# EasyEDA Pro project ProPrj_SunLight.epro

# Schematic Schematic1
Assembly Variant: Basic; Board Name: Board1; Create Date: 2026-07-05; Page Name: P1; Project Name: SunLight; Schematic Name: Schematic1; Update Date: 2026-07-05; Company: 嘉立创EDA; Page Size: A4; Version: V1.0
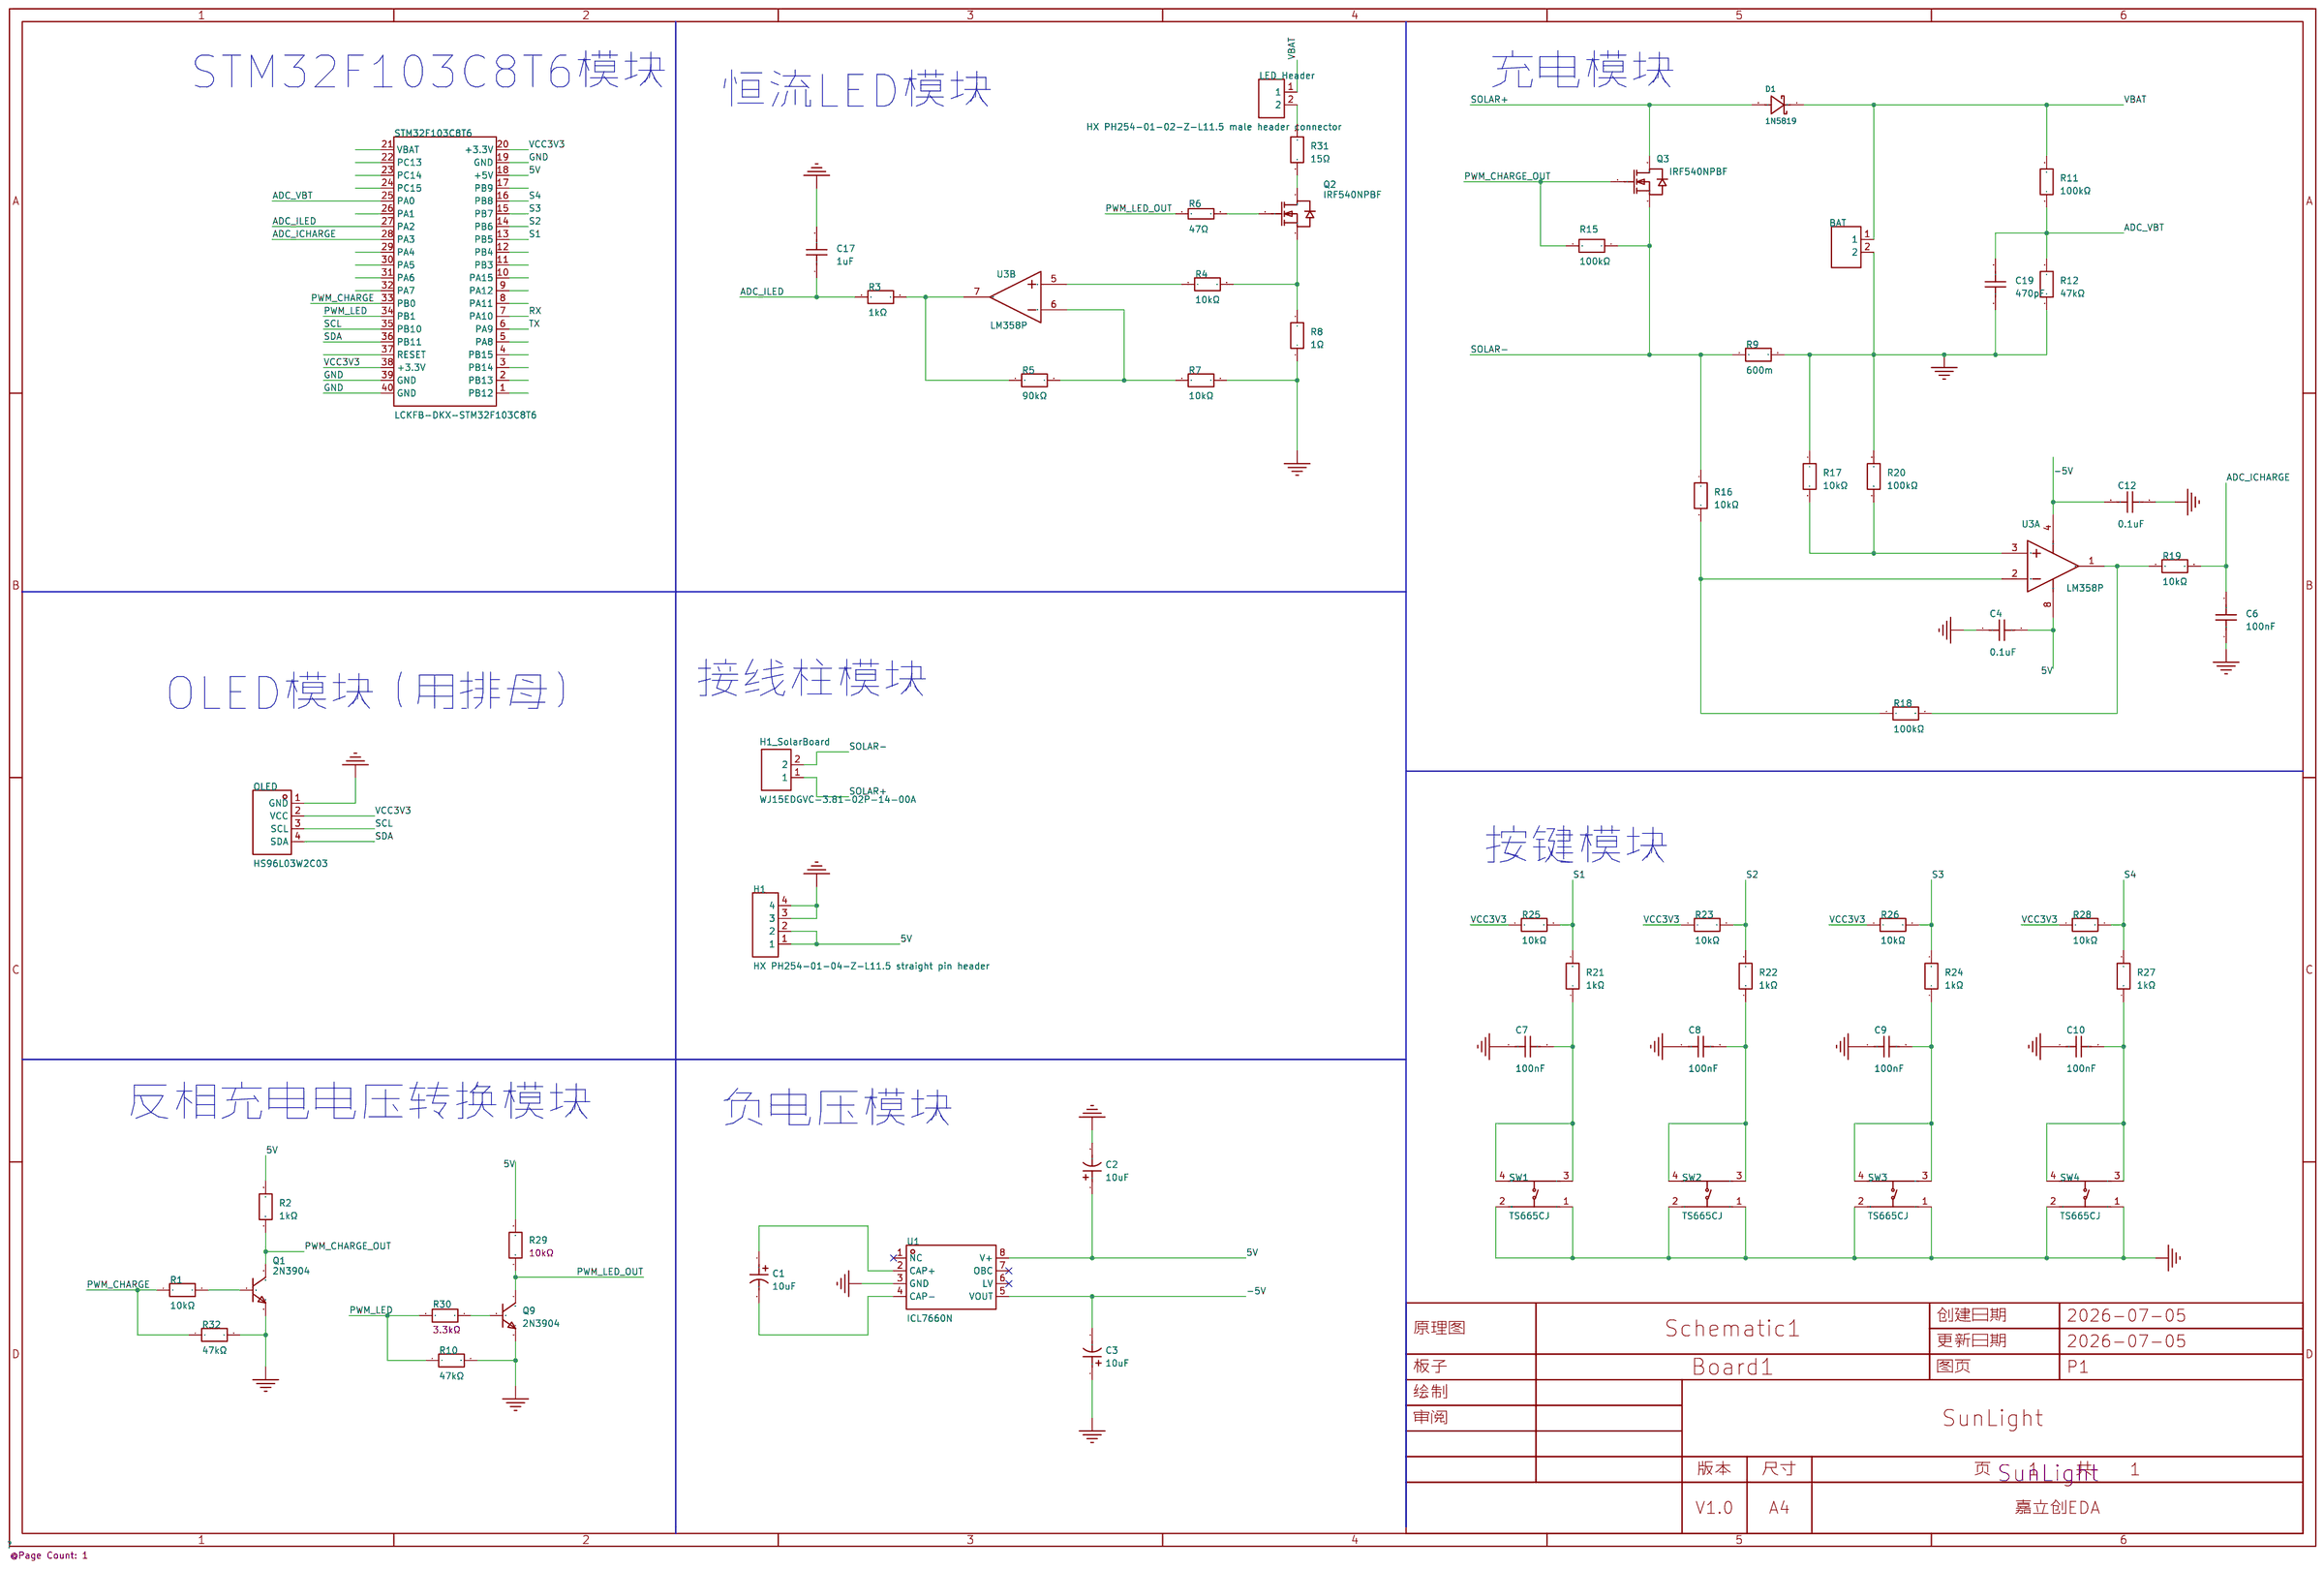
[diagram p0: schematic sheet]

## Parts
BAT  WJ15EDGVC-3.81-02P-14-00A  [CONN-TH_WJ15EDGVC-3.81-2P]
C1  10uF  [CAP-TH_BD10.0-P5.00-D0.6-FD_1]
C2  10uF  [CAP-TH_BD10.0-P5.00-D0.6-FD_1]
C3  10uF  [CAP-TH_BD10.0-P5.00-D0.6-FD_1]
C4  0.1uF  [CC1H104ZA1FD3F6C1000]
C6  100nF  [CAP-TH_L5.5-W4.0-P5.00-D0.5]
C7  100nF  [CAP-TH_L5.5-W4.0-P5.00-D0.5]
C8  100nF  [CAP-TH_L5.5-W4.0-P5.00-D0.5]
C9  100nF  [CAP-TH_L5.5-W4.0-P5.00-D0.5]
C10  100nF  [CAP-TH_L5.5-W4.0-P5.00-D0.5]
C12  0.1uF  [CC1H104ZA1FD3F6C1000]
C17  1uF  [CAP-TH_L5.8-W2.8]
C19  470pF  [CAP-TH_L5.5-W4.0-P5.00-D0.5]
D1  1N5819  [DO-41_BD2.4-L4.7-P8.70-D0.9-RD]
H1  HX PH254-01-04-Z-L11.5 straight pin header  [HDR-TH_4P-HX-PH254-01-04-Z-L11.5]
H1_SolarBoard  WJ15EDGVC-3.81-02P-14-00A  [CONN-TH_WJ15EDGVC-3.81-2P]
LED_Header  HX PH254-01-02-Z-L11.5 male header connector  [HDR-TH_2P-P2.54-V-M]
OLED  HS96L03W2C03  [OLED-TH_L27.8-W27.2-P2.54_C9900033791]
Q1  2N3904  [TO-92-3_L4.6-W3.6-P1.27-L_1]
Q2  IRF540NPBF  [TO-220-3_L10.0-W4.5-P2.54-L]
Q3  IRF540NPBF  [TO-220-3_L10.0-W4.5-P2.54-L]
Q9  2N3904  [TO-92-3_L4.6-W3.6-P1.27-L_1]
R1  10kΩ  [RES-TH_BD2.7-L6.2-P10.20-D0.4]
R2  1kΩ  [RES-TH_BD2.7-L6.2-P10.20-D0.4]
R3  1kΩ  [RES-TH_BD2.7-L6.2-P10.20-D0.4]
R4  10kΩ  [RES-TH_BD2.7-L6.2-P10.20-D0.4]
R5  90kΩ  [RES-TH_BD2.7-L6.2-P10.20-D0.4]
R6  47Ω  [RES-TH_BD2.4-L6.3-P10.30-D0.6]
R7  10kΩ  [RES-TH_BD2.7-L6.2-P10.20-D0.4]
R8  1Ω  [RES-TH_BD2.7-L6.2-P10.20-D0.4]
R9  600m  [RES-TH_BD2.7-L6.2-P10.20-D0.4]
R10  47kΩ  [RES-TH_BD2.7-L6.2-P10.20-D0.4]
R11  100kΩ  [RES-TH_BD2.7-L6.2-P10.20-D0.4]
R12  47kΩ  [RES-TH_BD2.7-L6.2-P10.20-D0.4]
R15  100kΩ  [RES-TH_BD2.7-L6.2-P10.20-D0.4]
R16  10kΩ  [RES-TH_BD2.7-L6.2-P10.20-D0.4]
R17  10kΩ  [RES-TH_BD2.7-L6.2-P10.20-D0.4]
R18  100kΩ  [RES-TH_BD2.7-L6.2-P10.20-D0.4]
R19  10kΩ  [RES-TH_BD2.7-L6.2-P10.20-D0.4]
R20  100kΩ  [RES-TH_BD2.7-L6.2-P10.20-D0.4]
R21  1kΩ  [RES-TH_BD2.7-L6.2-P10.20-D0.4]
R22  1kΩ  [RES-TH_BD2.7-L6.2-P10.20-D0.4]
R23  10kΩ  [RES-TH_BD2.7-L6.2-P10.20-D0.4]
R24  1kΩ  [RES-TH_BD2.7-L6.2-P10.20-D0.4]
R25  10kΩ  [RES-TH_BD2.7-L6.2-P10.20-D0.4]
R26  10kΩ  [RES-TH_BD2.7-L6.2-P10.20-D0.4]
R27  1kΩ  [RES-TH_BD2.7-L6.2-P10.20-D0.4]
R28  10kΩ  [RES-TH_BD2.7-L6.2-P10.20-D0.4]
R29  1kΩ  [RES-TH_BD2.7-L6.2-P10.20-D0.4]
R30  1kΩ  [RES-TH_BD2.7-L6.2-P10.20-D0.4]
R31  15Ω  [RES-TH_BD2.7-L6.2-P10.20-D0.4]
R32  47kΩ  [RES-TH_BD2.7-L6.2-P10.20-D0.4]
STM32F103C8T6  LCKFB-DKX-STM32F103C8T6  [CONN-TH_L53.3-W22.9_STM32F103C8T6-CARD]
SW1  TS665CJ  [SW-TH_4P-L6.0-W6.0-P4.50-LS6.5]
SW2  TS665CJ  [SW-TH_4P-L6.0-W6.0-P4.50-LS6.5]
SW3  TS665CJ  [SW-TH_4P-L6.0-W6.0-P4.50-LS6.5]
SW4  TS665CJ  [SW-TH_4P-L6.0-W6.0-P4.50-LS6.5]
U1  ICL7660N  [DIP-8_L9.4-W6.4-P2.54-LS9.1-BL]
U3  LM358P  [DIP-8_L9.7-W6.4-P2.54-LS7.6-BL]  (sections 1,2)

## Library data of the parts
BAT H1_SolarBoard = WJ15EDGVC-3.81-02P-14-00A: 连接器类型:板端/插座-闭口;固定方式:-;结构:1x2P;间距:3.81mm;颜色:绿色;安装方式:直插;排数:1;每排PIN数:2;额定电流:8A;额定电压:300V;线规 - AWG:-;线规 - 平方毫米:-;工作温度:-40℃~+105℃;; LCSC Part Name: 1x2P 3.81mm 排数:1 每排P数:2; Supplier Part: C8396; Manufacturer: KANGNEX(康奈克斯电气); Supplier Footprint: 插件,P=3.81mm; JLCPCB Part Class: Extended Part; Datasheet: https://item.szlcsc.com/datasheet/WJ15EDGVC-3.81-02P-14-00A/8890.html; Supplier: LCSC; Connector Type: 板端/插座-闭口; Number of Positions or Pins: 1x2P; Pitch: 3.81mm; Color: 绿色; Mounting Type: 直插; Number of Pins: 2P; Number of Rows: 1; Number of PINs Per Row: 2; Current Rating: 8A; Voltage Rating (Max): 300V; Operating Temperature: -40℃~+105℃
C1-C3 = ERG450V10M10x16: 容值:10uF;精度:±20%;额定电压:450V;纹波电流:100mA@100kHz;等效串联电阻(ESR):9.45Ω@100kHz;; LCSC Part Name: 10uF ±20% 450V; Supplier Part: C46552835; Manufacturer: JIERR(捷而瑞); Supplier Footprint: 插件,D10xL16mm; JLCPCB Part Class: Extended Part; Datasheet: https://item.szlcsc.com/datasheet/ERG450V10M10x16/48687203.html; Supplier: LCSC; Tolerance: ±20%; Voltage Rating: 450V; Ripple Current: 100mA@100kHz; Equivalent Series Resistance(ESR): 9.45Ω@100kHz; Pin Spacing: 5mm; Diameter: 10mm; Height - Seated (Max): 16mm; Lifetime: 2000hrs@105℃; Operating Temperature: -25℃~+105℃
C4 C12 = CC1H104ZA1ED3F5O1100: 容值:100nF;精度:-20%~+80%;额定电压:50V;温度系数:Y5V;; LCSC Part Name: 100nF -20%~+80% 50V; Supplier Part: C2761728; Manufacturer: Dersonic(德尔创); Supplier Footprint: 插件,P=2.54mm; JLCPCB Part Class: 扩展库; Datasheet: https://atta.szlcsc.com/upload/public/pdf/source/20211025/1A7587EB9213FE403B9063878B9D301B.pdf; Supplier: LCSC; Tolerance: -20%~+80%; Voltage Rated: 50V; Lead Spacing: 2.54mm; Temperature Coefficient: Y5V; φD: 5.8mm; Body Thickness: 2.6mm
C6-C10 C19 = Y5P102K2KV16CC0224: 容值:1nF;精度:±10%;额定电压:2kV;温度系数:SL;; LCSC Part Name: 1nF ±10% 2kV; Supplier Part: C2887266; Manufacturer: KNSCHA(科尼盛); Supplier Footprint: 插件,P=5mm; JLCPCB Part Class: Extended Part; Datasheet: https://item.szlcsc.com/datasheet/Y5P102K2KV16CC0224/3103834.html; Supplier: LCSC; Tolerance: ±10%; Voltage Rating: 2kV; Pin Spacing: 5mm; Temperature Coefficient: SL
C17 = CC1H104MC1FD3F6C10SA: 容值:100nF;精度:±20%;额定电压:50V;温度系数:Y5V;; LCSC Part Name: 100nF ±20% 50V; Supplier Part: C5375966; Manufacturer: Dersonic(德尔创); Supplier Footprint: 插件,P=5.08mm; JLCPCB Part Class: Extended Part; Datasheet: https://item.szlcsc.com/datasheet/CC1H104MC1FD3F6C10SA/6236644.html; Supplier: LCSC; Tolerance: ±20%; Voltage Rating: 50V; Pin Spacing: 5.08mm; Temperature Coefficient: Y5V; Diameter: 5.8mm; Body Thickness: 2.4mm
D1 = 1N5819_C54795756: 二极管配置:1个独立式;正向压降(Vf):550mV@1A;直流反向耐压(Vr):40V;整流电流:1A;; Supplier Part: C54795756; Manufacturer: R+O(宏嘉诚); Supplier Footprint: DO-41; JLCPCB Part Class: Extended Part; Datasheet: https://item.szlcsc.com/datasheet/1N5819/58234768.html; Supplier: LCSC; Diode Configuration: 1个独立式; Voltage - Forward(Vf@If): 550mV@1A; Voltage - DC Reverse(Vr): 40V; Current - Rectified: 1A; Reverse Leakage Current (Ir): 200uA@40V
H1 = HX PH254-01-04-Z-L11.5 straight pin header: 插针结构:1x4P;间距:2.54mm;圆针/方针:方针;安装方式:直插;排数:单排;总PIN位数:4P;额定电流:3A;额定电压:1kV;配合针长度:6mm;塑高:2.5mm;端接针长度:3mm;触头材质:黄铜;触头镀层:金;工作温度:-40℃~+105℃;; LCSC Part Name: 1x4P 间距:2.54mm 方针 直插; Supplier Part: C52016392; Manufacturer: hanxia(韩下); Supplier Footprint: 插件,P=2.54mm; JLCPCB Part Class: Extended Part; Datasheet: https://item.szlcsc.com/datasheet/HX%2520PH254-01-04-Z-L11.5%2520straight%2520pin%2520header/54760437.html; Supplier: LCSC; Pin Structure: 1x4P; Pitch: 2.54mm; Circluar Pins/Square Pins: 方针; Mounting Type: 直插; Number of Rows: 单排; Number of Pins: 4P; Current Rating: 3A; Voltage Rating (Max): 1kV; Length of Mating Pin: 6mm; Insulation Height: 2.5mm; Length of End Connection Pin: 3mm; Contact Material: 黄铜; Contact Plating: 金; Operating Temperature: -40℃~+105℃
LED_Header = HX PH254-01-02-Z-L11.5 male header connector: 插针结构:1x2P;间距:2.54mm;圆针/方针:方针;安装方式:直插;排数:单排;总PIN位数:2P;额定电流:3A;额定电压:1kV;配合针长度:6mm;塑高:2.5mm;端接针长度:3mm;触头材质:黄铜;触头镀层:金;工作温度:-40℃~+105℃;; LCSC Part Name: 1x2P 间距:2.54mm 方针 直插; Supplier Part: C52016390; Manufacturer: hanxia(韩下); Supplier Footprint: 插件,P=2.54mm; JLCPCB Part Class: Extended Part; Datasheet: https://item.szlcsc.com/datasheet/HX%2520PH254-01-02-Z-L11.5%2520male%2520header%2520connector/54760435.html; Supplier: LCSC; Pin Structure: 1x2P; Pitch: 2.54mm; Circluar Pins/Square Pins: 方针; Mounting Type: 直插; Number of Rows: 单排; Number of Pins: 2P; Current Rating: 3A; Voltage Rating (Max): 1kV; Length of Mating Pin: 6mm; Insulation Height: 2.5mm; Length of End Connection Pin: 3mm; Contact Material: 黄铜; Contact Plating: 金; Operating Temperature: -40℃~+105℃
OLED = HS96L03W2C03: 核心芯片:SSD1315芯片;接口类型:I2C;尺寸(inch):0.96;像素分辨率:128x64;; LCSC Part Name: 0.96寸OLED显示屏窄白光IIC; Supplier Part: C5248080; Manufacturer: HS(汉昇); JLCPCB Part Class: Extended Part; Datasheet: https://item.szlcsc.com/datasheet/HS96L03W2C03/5960631.html; Supplier: LCSC; Controller Type: SSD1315芯片; Interface: I2C; Size: 0.96; Dot Pixels: 128x64; Operating Temperature: -40℃~+70℃; Type of Drive: 无源(PMOLED); Display Range: 21.744x10.864mm; Display Color: 白色; Luminance: 180cd/m2
Q1 Q9 = 2N3904_C2874602: 晶体管类型:NPN;集电极电流(Ic):200mA;集射极击穿电压(Vceo):40V;耗散功率(Pd):625mW;直流电流增益(hFE):-;; LCSC Part Name: NPN 电流:200mA 电压:40V; Supplier Part: C2874602; Manufacturer: JSMSEMI(杰盛微); Supplier Footprint: TO-92; JLCPCB Part Class: Extended Part; Datasheet: https://item.szlcsc.com/datasheet/2N3904/3079917.html; Supplier: LCSC; type: NPN; Current - Collector(Ic): 200mA; Collector - Emitter Voltage VCEO: 40V; Pd - Power Dissipation: 625mW; Transition frequency(fT): 300MHz; Current - Collector Cutoff: 50nA; Vce Saturation(VCE(sat)): 300mV@50mA,5.0mA; Operating Temperature: -55℃~+150℃; Emitter-Base Voltage(Vebo): 6V; Number: 1个NPN
Q2 Q3 = IRF540NPBF: 类型:1个N沟道;漏源电压(Vdss):100V;连续漏极电流(Id):33A;导通电阻(RDS(on)@Vgs,Id):44mΩ@10V,16A;功率(Pd):130W;阈值电压(Vgs(th)@Id):4V@250uA;; LCSC Part Name: 1个N沟道 耐压:100V 电流:33A; Supplier Part: C2566; Manufacturer: Infineon(英飞凌); Supplier Footprint: TO-220AB; JLCPCB Part Class: Extended Part; Datasheet: https://atta.szlcsc.com/upload/public/pdf/source/20140818/1457707225950.pdf; Supplier: LCSC; Type: 1个N沟道; Drain Source Voltage (Vdss): 100V; Continuous Drain Current (Id): 33A; Drain Source On Resistance (RDS(on)@Vgs,Id): 44mΩ@10V,16A; Power Dissipation (Pd): 130W; Gate Threshold Voltage (Vgs(th)@Id): 4V@250uA; Total Gate Charge (Qg@Vgs): 71nC; Input Capacitance (Ciss@Vds): 1.96nF; Reverse Transfer Capacitance (Crss@Vds): 40pF; Operating Temperature: -55℃~+175℃
R1-R5 R7-R9 R11 R12 R15-R28 = MF1/4W-1K±1%-ST52: 电阻类型:金属膜电阻;阻值:1kΩ;精度:±1%;功率:250mW;温度系数:±100ppm/℃;; LCSC Part Name: 金属膜电阻 1kΩ ±1% 250mW; Supplier Part: C2903245; Manufacturer: VO(翔胜); Supplier Footprint: 插件,D2.7xL6.2mm; JLCPCB Part Class: Extended Part; Datasheet: https://item.szlcsc.com/datasheet/MF1%252F4W-1K%25C2%25B11%2525-ST52/3158996.html; Supplier: LCSC; Type: 金属膜电阻; Tolerance: ±1%; Voltage-Supply(Max): 250V; Power(Watts): 250mW; Temperature Coefficient: ±100ppm/℃; Operating Temperature: -55℃~+155℃
R6 = MFR-25FTE52-47R: 电阻类型:金属膜电阻;阻值:47Ω;精度:±1%;功率:250mW;温度系数:±50ppm/℃;; LCSC Part Name: 金属膜电阻 47Ω ±1% 250mW 铜脚，圆柱状直插; Supplier Part: C173022; Manufacturer: YAGEO(国巨); Supplier Footprint: 插件,D2.4xL6.3mm; JLCPCB Part Class: Extended Part; Datasheet: https://item.szlcsc.com/datasheet/MFR-25FTE52-47R/184411.html; Supplier: LCSC; Type: 金属膜电阻; Tolerance: ±1%; Power(Watts): 250mW; Temperature Coefficient: ±50ppm/℃; Operating Temperature: -55℃~+155℃
R10 R32 = MF1/4W-47K±1%-ST52: 电阻类型:金属膜电阻;阻值:47kΩ;精度:±1%;功率:250mW;温度系数:±350ppm/℃;; LCSC Part Name: 金属膜电阻 47kΩ ±1% 250mW; Supplier Part: C2857423; Manufacturer: VO(翔胜); Supplier Footprint: 插件,D2.7xL6.2mm; JLCPCB Part Class: Extended Part; Supplier: LCSC; Type: 金属膜电阻; Tolerance: ±1%; Overload Voltage (Max): 250V; Power(Watts): 250mW; Temperature Coefficient: ±350ppm/℃; Operating Temperature Range: -55℃~+155℃
R29 = MF1/4W-1K±1%-ST52: 电阻类型:金属膜电阻;阻值:1kΩ;精度:±1%;功率:250mW;温度系数:±100ppm/℃;; LCSC Part Name: 金属膜电阻 1kΩ ±1% 250mW; Supplier Part: C2903245; Manufacturer: VO(翔胜); Supplier Footprint: 插件,D2.7xL6.2mm; JLCPCB Part Class: Extended Part; Datasheet: https://item.szlcsc.com/datasheet/MF1%252F4W-1K%25C2%25B11%2525-ST52/3158996.html; Supplier: LCSC; Type: 金属膜电阻; Tolerance: ±1%; Voltage-Supply(Max): 250V; Power(Watts): 250mW; Temperature Coefficient: ±100ppm/℃; Operating Temperature: -55℃~+155℃; Resistance: 10kΩ
R30 = MF1/4W-1K±1%-ST52: 电阻类型:金属膜电阻;阻值:1kΩ;精度:±1%;功率:250mW;温度系数:±100ppm/℃;; LCSC Part Name: 金属膜电阻 1kΩ ±1% 250mW; Supplier Part: C2903245; Manufacturer: VO(翔胜); Supplier Footprint: 插件,D2.7xL6.2mm; JLCPCB Part Class: Extended Part; Datasheet: https://item.szlcsc.com/datasheet/MF1%252F4W-1K%25C2%25B11%2525-ST52/3158996.html; Supplier: LCSC; Type: 金属膜电阻; Tolerance: ±1%; Voltage-Supply(Max): 250V; Power(Watts): 250mW; Temperature Coefficient: ±100ppm/℃; Operating Temperature: -55℃~+155℃; Resistance: 3.3kΩ
R31 = MF1/4W-4Ω7±1%-OT26: 电阻类型:金属膜电阻;阻值:4.7Ω;精度:±1%;功率:250mW;温度系数:±400ppm/℃;; LCSC Part Name: 金属膜电阻 4.7Ω ±1% 250mW; Supplier Part: C2843026; Manufacturer: VO(翔胜); Supplier Footprint: 插件,D2.7xL6.2mm; JLCPCB Part Class: Extended Part; Datasheet: https://item.szlcsc.com/datasheet/MF1%252F4W-4%25CE%25A97%25C2%25B11%2525-OT26/3029405.html; Supplier: LCSC; Type: 金属膜电阻; Tolerance: ±1%; Voltage-Supply(Max): 250V; Power(Watts): 250mW; Temperature Coefficient: ±400ppm/℃; Operating Temperature: -55℃~+155℃
STM32F103C8T6 = LCKFB-DKX-STM32F103C8T6: 搭载Contex M3内核,程序存储容量64KB,RAM总容量20KB,最高72MHz主频,提供高效的计算能力和稳定的运行环境。; LCSC Part Name: 立创·地阔星-STM32F103C8T6开发板; Supplier Part: C22396880; Manufacturer: 立创开发板; JLCPCB Part Class: Extended Part; Datasheet: https://item.szlcsc.com/datasheet/LCKFB-DKX-STM32F103C8T6/24005615.html; Supplier: LCSC
SW1-SW4 = TS665CJ: 电路结构:单刀单掷;按钮形状:圆形按钮;作用力:2.5N;安装方式:直插;开关长度:6mm;开关宽度:6mm;开关高度:5mm;带支架:不带支架;触点电流:50mA;额定电压:12V;带灯:无;工作寿命:5万次;; LCSC Part Name: 6*6*5mm 直插 轻触开关; Supplier Part: C393938; Manufacturer: SHOU HAN(首韩); Supplier Footprint: 插件-4P,6x6mm; JLCPCB Part Class: Extended Part; Datasheet: https://item.szlcsc.com/datasheet/TS665CJ/372550.html; Supplier: LCSC; Circuit: 单刀单掷; Actuator Style: 圆形按钮; Operating Force: 2.5N; Mounting Type: 直插; Length: 6mm; Width: 6mm; Switch Height: 5mm; with Bracket: 不带支架; Contact Current: 50mA; Voltage Rating: 12V; Actuator/Cap Color: 黑色; With Lamp: 无; Termination Style: PC引脚; Life: 5万次; Operating Temperature: -25℃~+70℃
U1 = ICL7660N: DC-DC电源管理芯片  高效率、实现负电压输出的电源极性反转变换器; Supplier Part: C19193423; Manufacturer: HGSEMI(华冠); Supplier Footprint: DIP-8; JLCPCB Part Class: Extended Part; Datasheet: https://atta.szlcsc.com/upload/public/pdf/source/20231208/A47A2180530992FCCD2558815FF503B1.pdf; Supplier: LCSC
U3 = LM358P_C5330384: 放大器数:2;轨到轨:-;增益带宽积(GBW):1MHz;输入失调电压(Vos):2mV;压摆率(SR):-;输入偏置电流(Ib):45nA;; LCSC Part Name: 双运算放大器; Supplier Part: C5330384; Manufacturer: Slkor(萨科微); Supplier Footprint: DIP-8; JLCPCB Part Class: Extended Part; Datasheet: https://item.szlcsc.com/datasheet/LM358P/6089161.html; Supplier: LCSC; Number of Channels: 2; Maximum Power Supply Range (Vdd-Vss): 36V; Gain Bandwidth Product: 1MHz; Vos - Input Offset Voltage: 2mV; Ib - Input Bias Current: 45nA; Input Offset Current(Ios): 3nA; Common Mode Rejection Ratio(CMRR): 85dB; Quiescent Current: 500uA; Output Current: 40mA; Operating Temperature: 0℃~+70℃; Single supply: 3V~36V; Dual Supply: -1.5V~18V

## Nets
5V: C2.1 C4.2 H1.1 H1.2 R2.2 R29.2 STM32F103C8T6.18(+5V) U1.8(V+) U3.8(VCC)
-5V: C3.2 C12.2 U1.5(VOUT) U3.4(GND)
GND: BAT.2 C2.2 C3.1 C4.1 C6.1 C7.1 C8.1 C9.1 C10.1 C12.1 C17.2 C19.1 H1.3 H1.4 OLED.1(GND) Q1.3(E) Q9.3(E) R7.2 R8.1 R9.2 R10.2 R12.1 R17.1 R20.2 R32.2 STM32F103C8T6.19(GND) STM32F103C8T6.39(GND) STM32F103C8T6.40(GND) SW1.1(A) SW1.2(B) SW2.1(A) SW2.2(B) SW3.1(A) SW3.2(B) SW4.1(A) SW4.2(B) U1.3(GND)
VBAT: BAT.1 D1.1(C) LED_Header.1 R11.2
VCC3V3: OLED.2(VCC) R23.1 R25.1 R26.1 R28.1 STM32F103C8T6.20(+3.3V) STM32F103C8T6.38(+3.3V)
ADC_ICHARGE: C6.2 R19.2 STM32F103C8T6.28(PA3)
ADC_ILED: C17.1 R3.1 STM32F103C8T6.27(PA2)
ADC_VBT: C19.2 R11.1 R12.2 STM32F103C8T6.25(PA0)
PWM_CHARGE: R1.1 R32.1 STM32F103C8T6.33(PB0)
PWM_CHARGE_OUT: Q1.1(C) Q3.1(G) R2.1 R15.2
PWM_LED: R10.1 R30.2 STM32F103C8T6.34(PB1)
PWM_LED_OUT: Q9.1(C) R6.1 R29.1
RX: STM32F103C8T6.7(PA10)
S1: R21.2 R25.2 STM32F103C8T6.13(PB5)
S2: R22.2 R23.2 STM32F103C8T6.14(PB6)
S3: R24.2 R26.2 STM32F103C8T6.15(PB7)
S4: R27.2 R28.2 STM32F103C8T6.16(PB8)
SCL: OLED.3(SCL) STM32F103C8T6.35(PB10)
SDA: OLED.4(SDA) STM32F103C8T6.36(PB11)
SOLAR+: D1.2(A) H1_SolarBoard.1 Q3.2(D)
SOLAR-: H1_SolarBoard.2 Q3.3(S) R9.1 R15.1 R16.1
TX: STM32F103C8T6.6(PA9)
$1N47: Q1.2(B) R1.2
$1N60: C1.1 U1.2(CAP+)
$1N61: C1.2 U1.4(CAP-)
$1N72: R3.2 R5.1 U3.7(OUT2)
$1N76: Q2.3(S) R4.2 R8.2
$1N96: R16.2 R18.1 U3.2(IN1-)
$1N97: R18.2 R19.1 U3.1(OUT1)
$1N102: C7.2 R21.1 SW1.3(C) SW1.4(D)
$1N111: C8.2 R22.1 SW2.3(C) SW2.4(D)
$1N116: C9.2 R24.1 SW3.3(C) SW3.4(D)
$1N121: C10.2 R27.1 SW4.3(C) SW4.4(D)
$1N162: Q9.2(B) R30.1
$1N174: Q2.2(D) R31.1
$1N175: LED_Header.2 R31.2
$1N181: R4.1 U3.5(IN2+)
$1N184: R5.2 R7.1 U3.6(IN2-)
$1N187: Q2.1(G) R6.2
$1N191: R17.2 R20.1 U3.3(IN1+)

Not connected (* = marked no-connect by the designer): STM32F103C8T6 1(PB12) 2(PB13) 3(PB14) 4(PB15) 5(PA8) 8(PA11) 9(PA12) 10(PA15) 11(PB3) 12(PB4) 17(PB9) 21(VBAT) 22(PC13) 23(PC14) 24(PC15) 26(PA1) 29(PA4) 30(PA5) 31(PA6) 32(PA7) 37(RESET); U1 1(NC)* 6(LV)* 7(OBC)*

## Notes on the sheet
- STM32F103C8T6模块
- 充电模块
- 恒流LED模块
- 接线柱模块
- OLED模块（用排母）
- 按键模块
- 反相充电电压转换模块
- 负电压模块

# Board PCB1
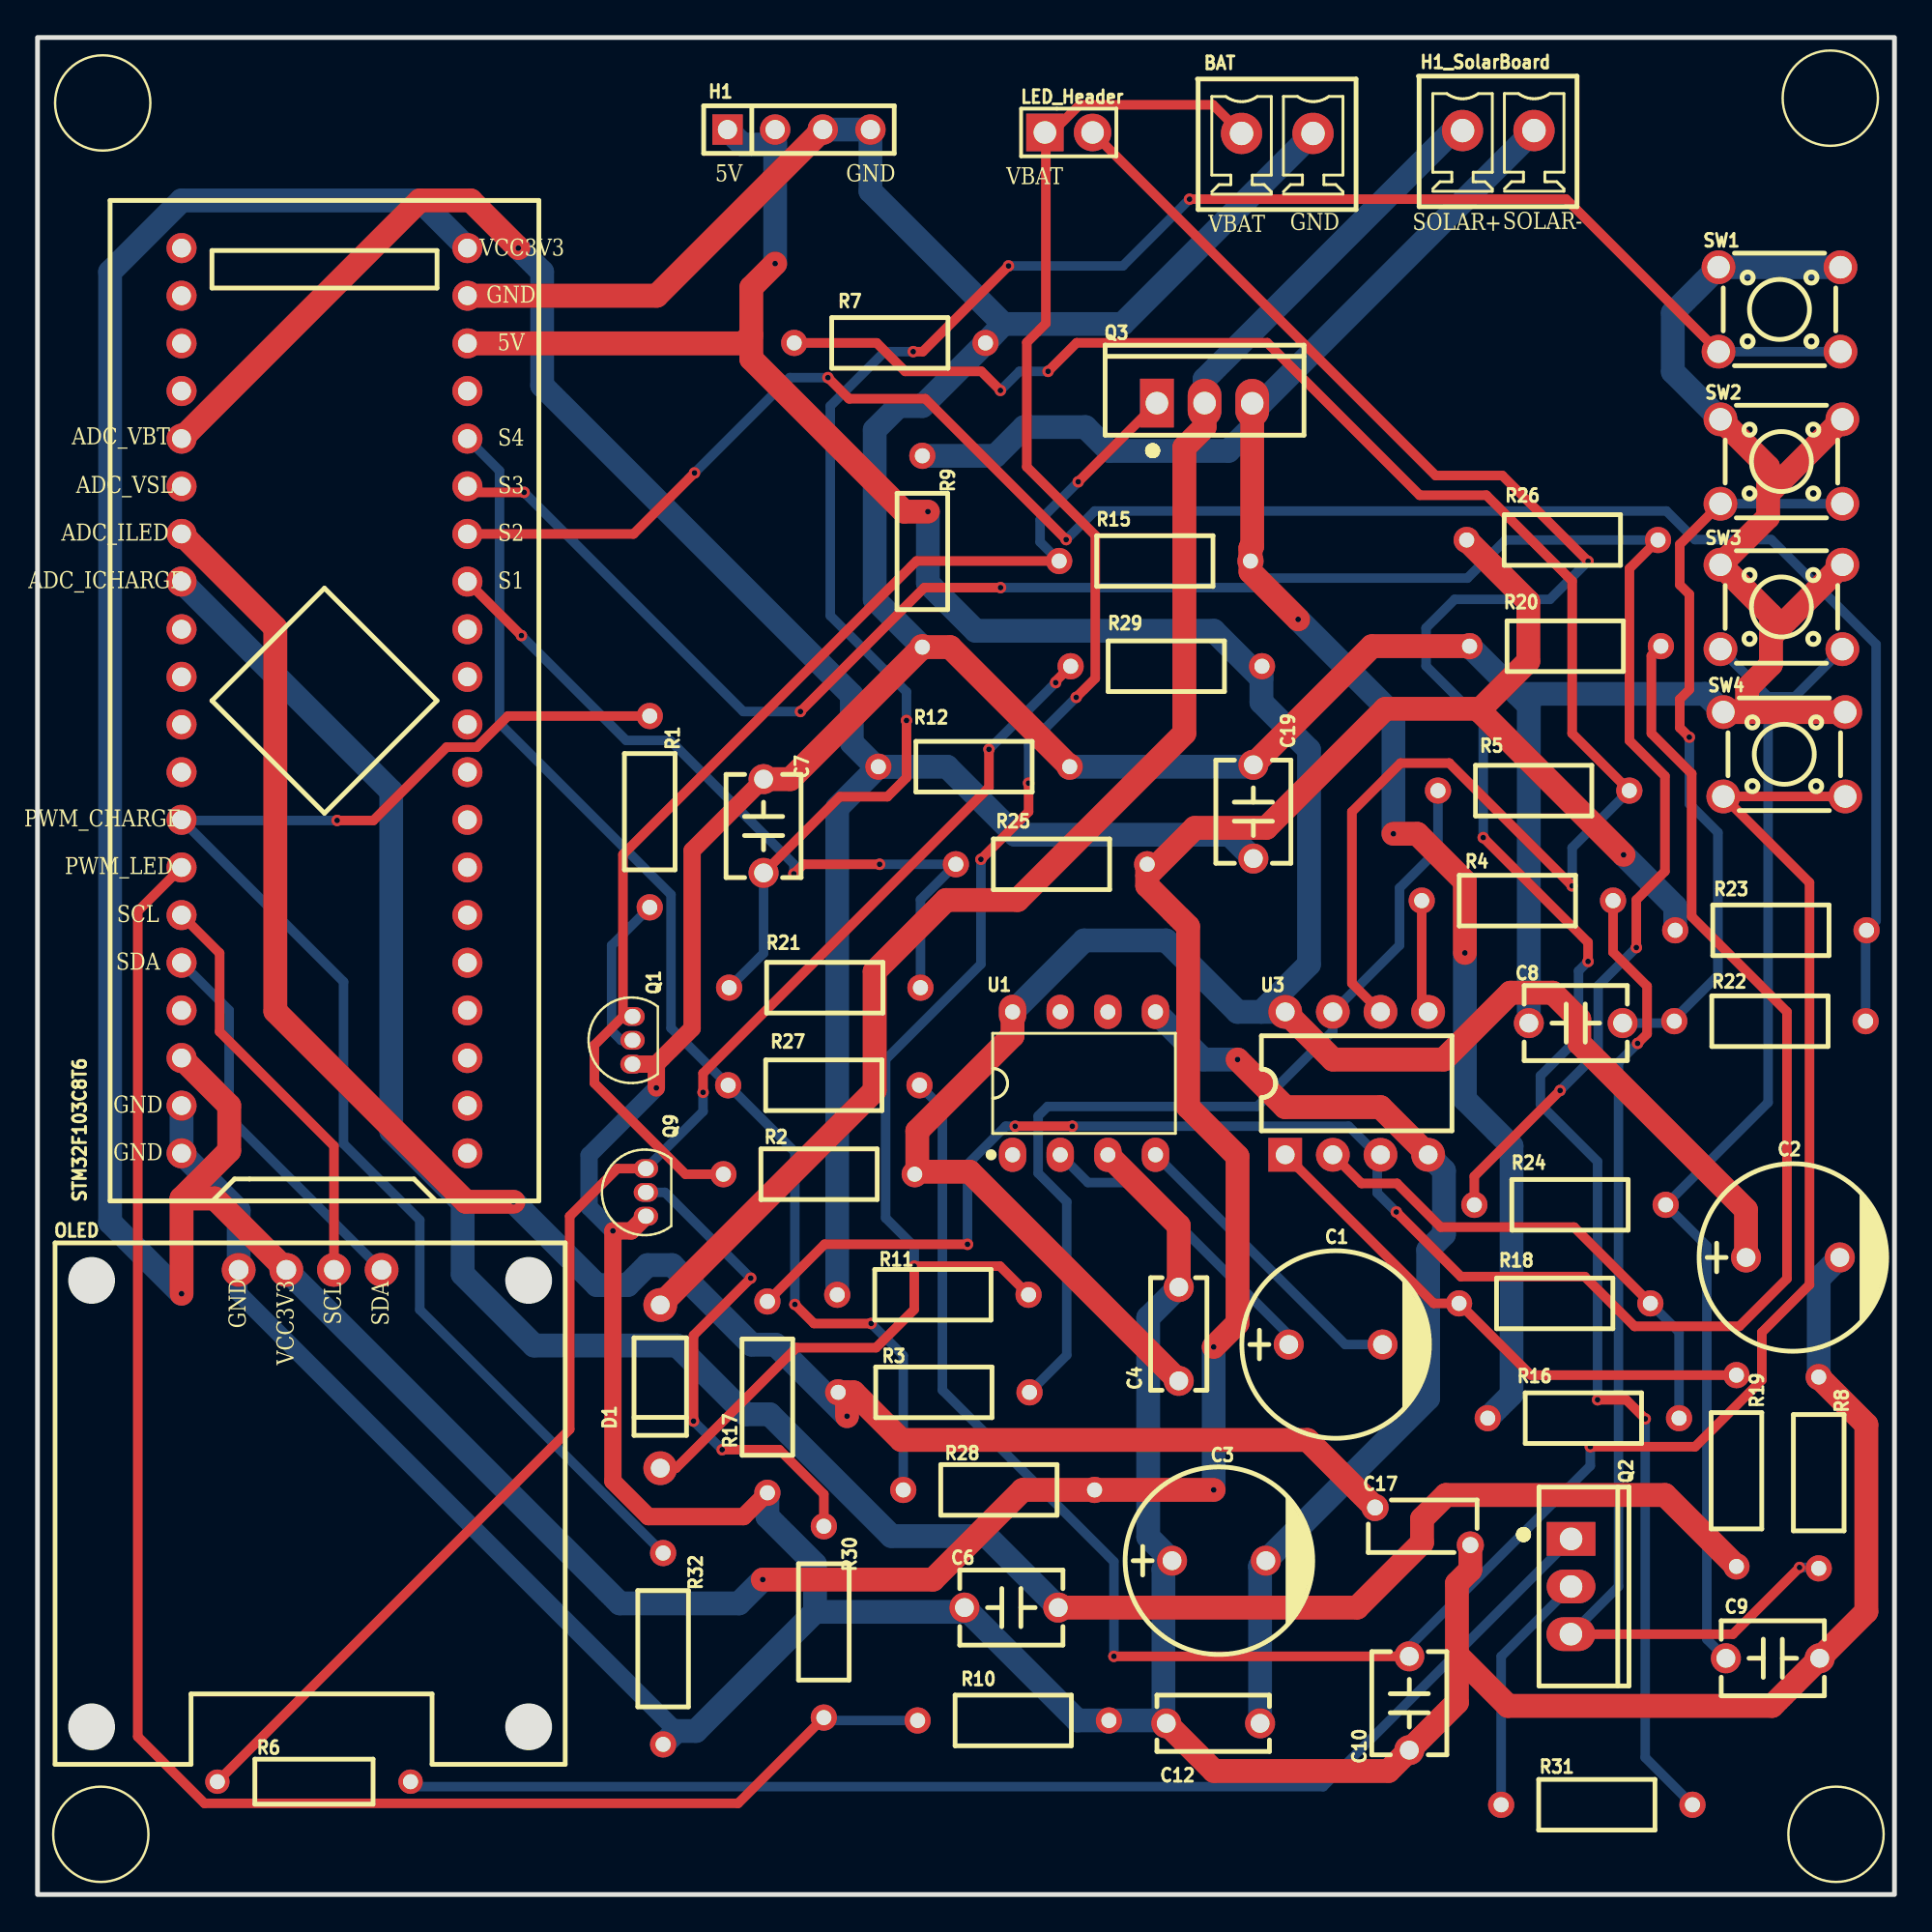
[diagram p1: board, top side]
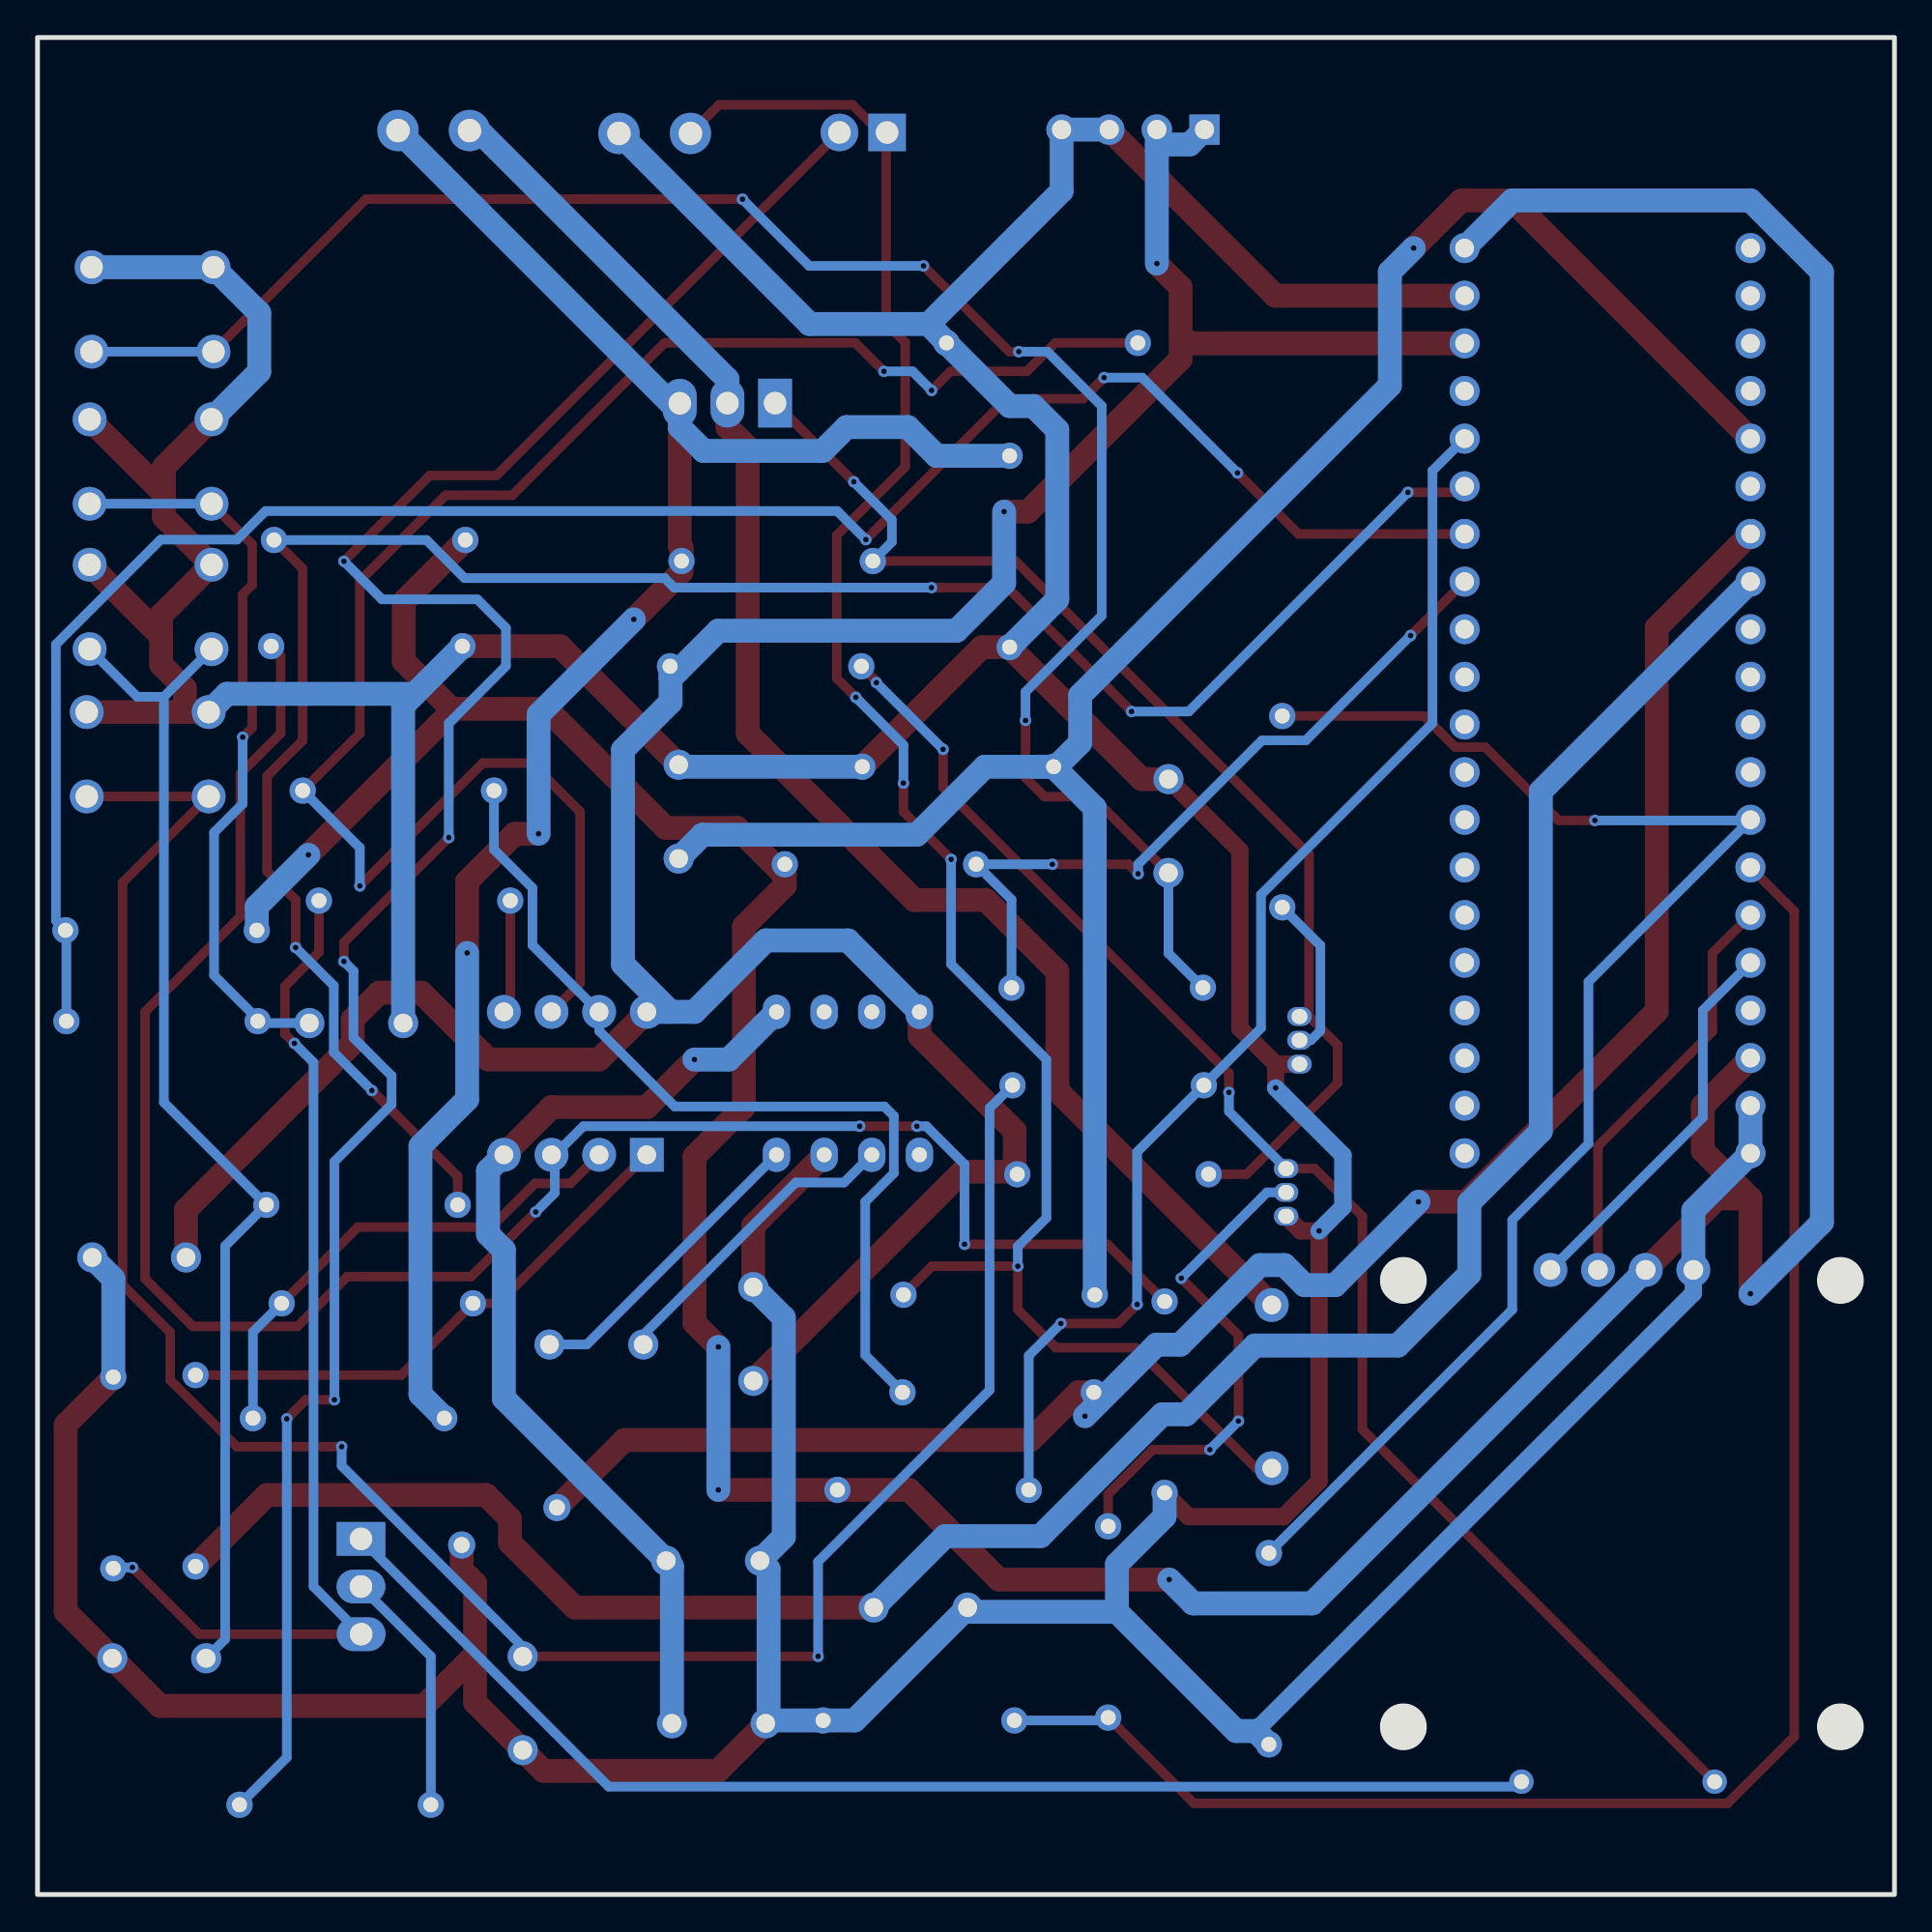
[diagram p2: board, bottom side, seen from below]

Outline 99 x 99 mm; copper layers: Top Layer, Bottom Layer. Coordinates in mm from the lower left corner of the outline.
Outline path: rectangle 0,99 99,0
Stack: Top Layer 0.035mm / Dielectric1 1.51mm FR4 er 4.5 / Bottom Layer 0.035mm

## Design rules (mm)
spacing 普通 (default): track to track 0.508, other pairs 0.152 to 0.3
spacing 高级: track to track 1.27, other pairs 0.152 to 0.3
spacing Plane_innerPlane: track to track 0.508, other pairs 0.152 to 0.3
spacing Copper_copperRegion: track to track 0.508, other pairs 0.152 to 0.3
track width copperThickness1oz (default): min 0.127, default 0.508, max 2.54
track width trackWidth1: min 0.127, default 1.27, max 2.54
differential pair differentialPair (default): width min 0.127, default 0.254, max 2.54; gap min 0.152, default 0.152
net VCC3V3 uses trackWidth1, 高级
net SOLAR+ uses trackWidth1, 高级
net ADC_VBT uses trackWidth1, 高级
net SOLAR- uses trackWidth1, 高级
net ADC_ILED uses trackWidth1, 高级
net ADC_ICHARGE uses trackWidth1, 高级
net -5V uses trackWidth1, 高级
net GND uses trackWidth1, 高级
net 5V uses trackWidth1, 高级

## Placement (name value [footprint] x y rotation side)
BAT  WJ15EDGVC-3.81-02P-14-00A  [CONN-TH_WJ15EDGVC-3.81-2P]  66.09 93.89 0 top
C1  10uF  [CAP-TH_BD10.0-P5.00-D0.6-FD_1]  69.21 29.32 0 top
C2  10uF  [CAP-TH_BD10.0-P5.00-D0.6-FD_1]  93.58 33.96 0 top
C3  10uF  [CAP-TH_BD10.0-P5.00-D0.6-FD_1]  62.98 17.79 0 top
C4  0.1uF  [CC1H104ZA1FD3F6C1000]  60.84 29.88 270 top
C6  100nF  [CAP-TH_L5.5-W4.0-P5.00-D0.5]  51.92 15.3 0 top
C7  100nF  [CAP-TH_L5.5-W4.0-P5.00-D0.5]  38.71 56.96 270 top
C8  100nF  [CAP-TH_L5.5-W4.0-P5.00-D0.5]  82.01 46.46 0 top
C9  100nF  [CAP-TH_L5.5-W4.0-P5.00-D0.5]  92.51 12.59 180 top
C10  100nF  [CAP-TH_L5.5-W4.0-P5.00-D0.5]  73.13 10.2 90 top
C12  0.1uF  [CC1H104ZA1FD3F6C1000]  62.68 9.12 0 top
C17  1uF  [CAP-TH_L5.8-W2.8]  73.85 19.63 0 top
C19  470pF  [CAP-TH_L5.5-W4.0-P5.00-D0.5]  64.82 57.73 270 top
D1  1N5819  [DO-41_BD2.4-L4.7-P8.70-D0.9-RD]  33.2 27.08 90 top
H1  HX PH254-01-04-Z-L11.5 straight pin header  [HDR-TH_4P-HX-PH254-01-04-Z-L11.5]  40.59 94.09 0 top
H1_SolarBoard  WJ15EDGVC-3.81-02P-14-00A  [CONN-TH_WJ15EDGVC-3.81-2P]  77.88 94.04 0 top
LED_Header  HX PH254-01-02-Z-L11.5 male header connector  [HDR-TH_2P-P2.54-V-M]  54.98 93.94 0 top
OLED  HS96L03W2C03  [OLED-TH_L27.8-W27.2-P2.54_C9900033791]  14.53 33.3 0 top
Q1  2N3904  [TO-92-3_L4.6-W3.6-P1.27-L_1]  31.72 45.54 270 top
Q2  IRF540NPBF  [TO-220-3_L10.0-W4.5-P2.54-L]  81.75 16.42 270 top
Q3  IRF540NPBF  [TO-220-3_L10.0-W4.5-P2.54-L]  62.22 79.5 0 top
Q9  2N3904  [TO-92-3_L4.6-W3.6-P1.27-L_1]  32.44 37.43 270 top
R1  10kΩ  [RES-TH_BD2.7-L6.2-P10.20-D0.4]  32.64 57.73 270 top
R2  1kΩ  [RES-TH_BD2.7-L6.2-P10.20-D0.4]  41.67 38.4 0 top
R3  1kΩ  [RES-TH_BD2.7-L6.2-P10.20-D0.4]  47.79 26.77 0 top
R4  10kΩ  [RES-TH_BD2.7-L6.2-P10.20-D0.4]  78.9 52.98 0 top
R5  90kΩ  [RES-TH_BD2.7-L6.2-P10.20-D0.4]  79.76 58.85 0 top
R6  47Ω  [RES-TH_BD2.4-L6.3-P10.30-D0.6]  14.74 6.01 0 top
R7  10kΩ  [RES-TH_BD2.7-L6.2-P10.20-D0.4]  45.44 82.72 0 top
R8  1Ω  [RES-TH_BD2.7-L6.2-P10.20-D0.4]  94.96 22.49 270 top
R9  600m  [RES-TH_BD2.7-L6.2-P10.20-D0.4]  47.17 71.6 270 top
R10  47kΩ  [RES-TH_BD2.7-L6.2-P10.20-D0.4]  52.02 9.28 0 top
R11  100kΩ  [RES-TH_BD2.7-L6.2-P10.20-D0.4]  47.74 31.97 0 top
R12  47kΩ  [RES-TH_BD2.7-L6.2-P10.20-D0.4]  49.93 60.12 180 top
R15  100kΩ  [RES-TH_BD2.7-L6.2-P10.20-D0.4]  59.57 71.09 180 top
R16  10kΩ  [RES-TH_BD2.7-L6.2-P10.20-D0.4]  82.41 25.39 0 top
R17  10kΩ  [RES-TH_BD2.7-L6.2-P10.20-D0.4]  38.91 26.52 90 top
R18  100kΩ  [RES-TH_BD2.7-L6.2-P10.20-D0.4]  80.88 31.51 180 top
R19  10kΩ  [RES-TH_BD2.7-L6.2-P10.20-D0.4]  90.58 22.59 270 top
R20  100kΩ  [RES-TH_BD2.7-L6.2-P10.20-D0.4]  81.45 66.55 180 top
R21  1kΩ  [RES-TH_BD2.7-L6.2-P10.20-D0.4]  41.97 48.34 0 top
R22  1kΩ  [RES-TH_BD2.7-L6.2-P10.20-D0.4]  92.36 46.56 0 top
R23  10kΩ  [RES-TH_BD2.7-L6.2-P10.20-D0.4]  92.41 51.4 0 top
R24  1kΩ  [RES-TH_BD2.7-L6.2-P10.20-D0.4]  81.7 36.77 180 top
R25  10kΩ  [RES-TH_BD2.7-L6.2-P10.20-D0.4]  54.06 54.92 180 top
R26  10kΩ  [RES-TH_BD2.7-L6.2-P10.20-D0.4]  81.29 72.21 0 top
R27  1kΩ  [RES-TH_BD2.7-L6.2-P10.20-D0.4]  41.92 43.14 180 top
R28  10kΩ  [RES-TH_BD2.7-L6.2-P10.20-D0.4]  51.25 21.57 180 top
R29  1kΩ  [RES-TH_BD2.7-L6.2-P10.20-D0.4]  60.18 65.48 0 top
R30  1kΩ  [RES-TH_BD2.7-L6.2-P10.20-D0.4]  41.92 14.53 270 top
R31  15Ω  [RES-TH_BD2.7-L6.2-P10.20-D0.4]  83.13 4.78 0 top
R32  47kΩ  [RES-TH_BD2.7-L6.2-P10.20-D0.4]  33.35 13.1 270 top
STM32F103C8T6  LCKFB-DKX-STM32F103C8T6  [CONN-TH_L53.3-W22.9_STM32F103C8T6-CARD]  15.3 63.64 90 top
SW1  TS665CJ  [SW-TH_4P-L6.0-W6.0-P4.50-LS6.5]  92.87 84.5 0 top
SW2  TS665CJ  [SW-TH_4P-L6.0-W6.0-P4.50-LS6.5]  92.97 76.39 0 top
SW3  TS665CJ  [SW-TH_4P-L6.0-W6.0-P4.50-LS6.5]  92.97 68.64 0 top
SW4  TS665CJ  [SW-TH_4P-L6.0-W6.0-P4.50-LS6.5]  93.12 60.79 0 top
U1  ICL7660N  [DIP-8_L9.4-W6.4-P2.54-LS9.1-BL]  55.79 43.24 0 top
U3  LM358P  [DIP-8_L9.7-W6.4-P2.54-LS7.6-BL]  70.33 43.24 0 top

## Footprints (pads in the part's own frame, mm; a bottom-side part is the same pattern mirrored in y, then rotated)
CAP-TH_BD10.0-P5.00-D0.6-FD_1
  round 1.6 hole 1: 1(-2.5,0) 2(2.5,0)
CAP-TH_L5.5-W4.0-P5.00-D0.5
  round 1.6 hole 1: 1(-2.5,0) 2(2.5,0)
CAP-TH_L5.8-W2.8
  round 1.45 hole 0.85: 1(-2.54,1) 2(2.54,-1)
CC1H104ZA1FD3F6C1000
  round 1.6 hole 1.001: 1(-2.499,0) 2(2.499,0)
CONN-TH_L53.3-W22.9_STM32F103C8T6-CARD
  round 1.6 hole 1: 1(-24.13,-7.62) 2(-21.59,-7.62) 3(-19.05,-7.62) 4(-16.51,-7.62) 5(-13.97,-7.62) 6(-11.43,-7.62) 7(-8.89,-7.62) 8(-6.35,-7.62) 9(-3.81,-7.62) 10(-1.27,-7.62) 11(1.27,-7.62) 12(3.81,-7.62) 13(6.35,-7.62) 14(8.89,-7.62) 15(11.43,-7.62) 16(13.97,-7.62) 17(16.51,-7.62) 18(19.05,-7.62) 19(21.59,-7.62) 20(24.13,-7.62) 21(24.13,7.62) 22(21.59,7.62) 23(19.05,7.62) 24(16.51,7.62) 25(13.97,7.62) 26(11.43,7.62) 27(8.89,7.62) 28(6.35,7.62) 29(3.81,7.62) 30(1.27,7.62) 31(-1.27,7.62) 32(-3.81,7.62) 33(-6.35,7.62) 34(-8.89,7.62) 35(-11.43,7.62) 36(-13.97,7.62) 37(-16.51,7.62) 38(-19.05,7.62) 39(-21.59,7.62) 40(-24.13,7.62)
CONN-TH_WJ15EDGVC-3.81-2P
  round 2.2 hole 1.25: 1(-1.905,0) 2(1.905,0)
DIP-8_L9.4-W6.4-P2.54-LS9.1-BL
  oval 1.46x1.825 hole 0.8: 1(-3.81,-3.81) 2(-1.27,-3.81) 3(1.27,-3.81) 4(3.81,-3.81) 5(3.81,3.81) 6(1.27,3.81) 7(-1.27,3.81) 8(-3.81,3.81)
DIP-8_L9.7-W6.4-P2.54-LS7.6-BL
  rect 1.8x1.8 hole 1: 1(-3.81,-3.81)
  round 1.8 hole 1: 2(-1.27,-3.81) 3(1.27,-3.81) 4(3.81,-3.81) 5(3.81,3.81) 6(1.27,3.81) 7(-1.27,3.81) 8(-3.81,3.81)
DO-41_BD2.4-L4.7-P8.70-D0.9-RD
  round 1.8 hole 1: 1(-4.35,0) 2(4.35,0)
HDR-TH_2P-P2.54-V-M
  rect 2x2 hole 1.2: 1(-1.27,0)
  round 2 hole 1.2: 2(1.27,0)
HDR-TH_4P-HX-PH254-01-04-Z-L11.5
  rect 1.62x1.62 hole 1.02: 1(-3.81,0)
  round 1.62 hole 1.02: 2(-1.27,0) 3(1.27,0) 4(3.81,0)
OLED-TH_L27.8-W27.2-P2.54_C9900033791
  round 1.8 hole 1.05: 1(-3.81,0) 2(-1.27,0) 3(1.27,0) 4(3.81,0)
RES-TH_BD2.4-L6.3-P10.30-D0.6
  round 1.3 hole 0.8: 1(-5.15,0) 2(5.15,0)
RES-TH_BD2.7-L6.2-P10.20-D0.4
  round 1.4 hole 0.8: 1(-5.1,0) 2(5.1,0)
SW-TH_4P-L6.0-W6.0-P4.50-LS6.5
  round 1.8 hole 1.2: 1(-3.25,2.25) 2(3.25,2.25) 3(-3.25,-2.25) 4(3.25,-2.25)
TO-92-3_L4.6-W3.6-P1.27-L_1
  oval 1x1.3 hole 0.8x0.84: 1(-1.27,0) 2(0,0) 3(1.27,0)
TO-220-3_L10.0-W4.5-P2.54-L
  rect 1.8x2.6 hole 1.2: 1(-2.54,0.005)
  oval 1.8x2.6 hole 1.2: 2(0,0.005) 3(2.54,-0.005)

## Nets
As in the schematic.

Pads without a net: U1 1 6 7

## Via types
v1: diameter 0.61, hole 0.305, Top Layer to Bottom Layer, 62 vias

## Routing (per net, layer and track width the routed paths; a pad name or vN(x,y) marks a point on that pad's centre or on a via; arc(x,y) is an arc through that point)
5V: length 170.2
  Top Layer w1.268: 46.9,38.54 46.9,40.7 51.98,45.78 U1.8 ; 46.9,38.54 R2.2 ; 46.9,38.54 49.69,38.54 C4.2 ; v1(39.33,86.95) 38.06,85.68 38.06,81.87 46.2,73.72 v1(47.47,73.72)
  Top Layer w1.27: 38.06,83.14 37.61,82.69 STM32F103C8T6.18 ; C2.1 91.08,36.5 82.19,45.39 82.19,46.66 80.78,48.08 78.53,48.08 74.97,44.51 69.06,44.51 U3.8
  Bottom Layer w1.268: 65.25,64.83 65.25,63.56 67.79,61.02 67.79,49.59 65.25,47.05 ; 65.25,64.83 R29.2 ; 65.25,64.83 62.71,67.37 50.01,67.37 47.47,69.91 v1(47.47,73.72) ; v1(39.33,86.95) H1.2
  Bottom Layer w1.27: 39.33,93.3 37.58,93.3 H1.1 ; U1.8 55.79,50.86 60.17,50.86 63.98,47.05 U3.8
-5V: length 52.8
  Top Layer w1.27: U3.4 71.6,41.97 66.52,41.97 v1(63.98,44.51)
  Bottom Layer w1.27: U3.4 74.98,38.59 74.98,35.2 74.14,34.35 74.14,26.45 65.18,17.49 ; C12.2 65.18,17.49 ; 65.18,17.49 C3.2 ; U1.5 62.14,44.51 v1(63.98,44.51)
GND: length 457.5
  Top Layer w0.923: 32.99,44.27 34.9,46.18 34.9,55.65 C7.1 ; 32.99,44.27 Q1.3 ; 32.99,44.27 v1(32.99,43) ; R17.1 37.64,20.15 32.56,20.15 30.68,22.03 v1(30.68,35.38) 31.65,35.38 Q9.3
  Top Layer w1.268: C7.1 40.14,59.46 R9.2 48.65,66.5 R12.1 ; C19.1 71.14,66.55 R20.2 ; R8.1 97.5,25.05 97.5,15.08 C9.1
  Top Layer w1.27: C17.2 76.39,17.3 75.67,16.59 75.67,10.24 C10.1 72.02,6.59 62.72,6.59 C12.1 ; C9.1 92.47,10.05 78.4,10.05 75.67,12.78 ; STM32F103C8T6.19 33.01,85.23 H1.3 ; 92.26,74.7 92.28,74.7 SW2.2 ; SW3.2 92.41,67.08 92.41,66.85 ; SW4.1 SW4.2 ; 91.15,63.04 91.15,64.31 92.41,65.58 92.41,68.2 SW3.1 92.26,73.43 92.26,76.1 SW2.1 ; C4.1 60.84,35.66 U1.3
  Bottom Layer w0.923: 34.07,8.72 10.72,32.06 OLED.1 ; v1(32.99,43) 29.41,39.41 29.41,36.65 v1(30.68,35.38)
  Bottom Layer w1.268: SW4.1 88.9,64.01 78.89,64.01 R20.2 ; 33.35,8 34.07,8.72 35.1,8.72 41.45,15.07 ; R12.1 64.72,60.12 C19.1 ; R9.2 44.63,69.04 44.63,78.08 45.9,79.35 47.17,79.35 R7.2 51.49,83.73 ; 41.45,15.07 41.45,17.61 38.91,20.15 R17.1 ; 41.45,15.07 49.19,15.07 C6.1 55.44,9.28 R10.2 60.03,9.28 C12.1 ; 51.49,83.73 57.84,83.73 BAT.2 ; 51.49,83.73 44.41,90.81 H1.4 ; C2.2 94.96,32.84 R8.1
  Bottom Layer w1.27: C8.1 79.51,63.39 78.89,64.01 ; 60.03,9.28 60.03,17.34 C3.1 59.21,19.06 59.21,30.75 C4.1 ; SW2.1 87.18,81.18 87.18,84.31 SW1.1 SW1.2 ; H1.4 H1.3 ; OLED.1 10.72,36.47 STM32F103C8T6.40 STM32F103C8T6.39
VBAT: length 105.4
  Top Layer w0.508: 53.76,93.89 54.03,93.89 55.55,95.41 62.67,95.41 BAT.1 ; 53.76,93.89 53.76,83.76 52.74,82.74 52.74,76.11 56.39,72.46 56.39,64.84 v1(55.38,63.82) ; 53.76,93.89 LED_Header.1 ; v1(50.3,55.19) 52.84,57.73 v1(52.84,59.25) ; 33.2,22.73 34.04,22.73 40.47,29.15 44.71,29.15 46.74,31.19 v1(46.74,33.5) 51.31,33.5 R11.2
  Bottom Layer w0.508: v1(55.38,63.82) 52.84,61.28 v1(52.84,59.25) ; v1(46.74,33.5) 46.74,34.55 45.22,36.07 45.22,44.52 50.3,49.6 v1(50.3,55.19)
VCC3V3: length 243.7
  Top Layer w1.268: v1(62.7,29.19) 63.97,30.46 63.97,39.35 61.34,41.98 61.34,51.6 59.16,53.78 R25.1 ; R26.1 79.48,68.93 79.48,65.75 76.94,63.21 ; 76.94,63.21 71.86,63.21 65.51,56.86 61.7,56.86 59.16,54.32 ; 76.94,63.21 76.94,63.05 v1(84.56,55.43) ; v1(38.66,16.79) 47.74,16.79 52.52,21.57 R28.1 v1(62.7,21.57)
  Top Layer w1.27: 7.68,37.11 10.22,39.65 10.22,42.05 STM32F103C8T6.38 ; 7.68,37.11 v1(7.68,32.03) ; 7.68,37.11 9.45,37.11 OLED.2
  Bottom Layer w1.268: v1(62.7,21.57) v1(62.7,29.19) ; v1(38.66,16.79) 37.39,15.52 31.04,15.52 OLED.2 ; R23.1 87.31,52.67 v1(84.56,55.43)
  Bottom Layer w1.27: STM32F103C8T6.20 20.38,90.31 7.68,90.31 3.87,86.5 3.87,35.84 v1(7.68,32.03)
ADC_ICHARGE: length 123.2
  Top Layer w1.268: R19.2 86.77,21.3 75.08,21.3 73.81,20.03 73.81,18.76 70.35,15.3 C6.2
  Bottom Layer w1.27: STM32F103C8T6.28 18.86,58.82 18.86,40.7 22.67,36.89 22.67,33.08 26.48,29.27 34.1,29.27 37.76,25.6 39.03,25.6 45.53,19.11 50.61,19.11 C6.2
ADC_ILED: length 100.3
  Top Layer w1.268: C17.1 67.71,24.23 46.05,24.23 43.51,26.77 R3.1 ; v1(25.38,36.93) 22.84,36.93 12.68,47.09 12.68,67.54 STM32F103C8T6.27 ; 43.16,26.77 v1(43.16,25.5)
  Bottom Layer w1.268: v1(25.38,36.93) 29.82,32.49 31.45,32.49 32.52,33.55 33.83,33.55 38.08,29.31 39.35,29.31 v1(43.16,25.5)
ADC_VBT: length 112.2
  Top Layer w1.268: STM32F103C8T6.25 20.38,90.31 23.09,90.31 v1(25.63,87.77)
  Bottom Layer w1.268: 45.95,60.12 44.68,60.12 43.41,61.39 43.41,63.94 26.9,80.44 26.9,86.5 v1(25.63,87.77) ; R11.1 42.63,57.93 R12.2 48.49,60.12 52.12,56.5 63.55,56.5 C19.2
PWM_CHARGE: length 77
  Top Layer w0.508: R1.1 25.08,62.83 23.42,61.17 21.81,61.17 17.9,57.26 v1(15.97,57.26)
  Bottom Layer w0.508: 7.71,57.26 16.31,48.66 16.31,40.02 20.38,35.96 20.38,31.18 R32.1 ; 7.71,57.26 STM32F103C8T6.33 ; 7.71,57.26 v1(15.97,57.26)
PWM_CHARGE_OUT: length 63.4
  Top Layer w0.508: Q1.1 31.21,46.81 ; 31.21,46.81 31.21,55.44 46.86,71.09 R15.2 ; 31.21,46.81 29.69,45.28 29.69,43.25 34.54,38.4 R2.1 ; v1(55.48,75.31) Q3.1
  Bottom Layer w0.508: v1(55.48,75.31) 53.45,73.28 53.45,72.11 R15.2
PWM_LED: length 92.3
  Top Layer w0.508: STM32F103C8T6.34 5.34,52.42 5.34,8.41 8.9,4.86 37.35,4.86 41.92,9.43
  Bottom Layer w0.508: R10.1 42.07,9.28 41.92,9.43
PWM_LED_OUT: length 79.2
  Top Layer w0.508: Q9.1 30.91,38.7 28.37,36.16 28.37,24.8 9.59,6.01 ; v1(35.48,42.76) 35.48,43.78 50.72,59.02 v1(50.72,61.05) ; v1(54.28,64.61) 54.28,64.68 R29.1
  Bottom Layer w0.508: Q9.1 35.48,41.75 v1(35.48,42.76) ; v1(50.72,61.05) v1(54.28,64.61)
S1: length 40.4
  Top Layer w0.508: v1(40.32,54.41) 40.83,54.92 v1(44.9,54.92) ; v1(25.8,67.11) STM32F103C8T6.13
  Bottom Layer w0.508: R21.2 47.07,53.04 R25.2 v1(44.9,54.92) ; v1(40.32,54.41) 40.32,54.92 33.72,61.53 31.39,61.53 v1(25.8,67.11)
S2: length 106
  Top Layer w0.508: v1(42.14,80.87) 43.27,79.74 47.33,79.74 v1(54.84,72.23) ; STM32F103C8T6.14 31.77,72.53 v1(35.03,75.79)
  Bottom Layer w0.508: v1(42.14,80.87) 40.11,80.87 v1(35.03,75.79) ; R22.2 97.46,51.35 R23.2 98.02,51.91 98.02,66.64 92.43,72.23 88.37,72.23 86.84,73.76 56.36,73.76 v1(54.84,72.23)
S3: length 113.3
  Top Layer w0.508: v1(25.94,74.75) 23.24,74.75 STM32F103C8T6.15 ; R26.2 84.87,70.69 84.87,61.52 86.76,59.63 86.76,54.55 85.24,53.02 v1(85.24,50.48) ; R24.2 76.6,38.29 v1(81.17,42.86) ; v1(51.34,69.67) 47.28,69.67 v1(40.67,63.07)
  Bottom Layer w0.508: R26.2 78.27,72.21 76.23,70.18 65.56,70.18 65.06,69.67 v1(51.34,69.67) ; v1(85.24,50.48) 83.21,48.45 83.21,44.89 v1(81.17,42.86) ; v1(40.67,63.07) 37.62,63.07 v1(25.94,74.75)
S4: length 67.5
  Top Layer w0.508: v1(40.38,31.46) 41.39,30.44 v1(44.44,30.44)
  Bottom Layer w0.508: v1(40.38,31.46) 40.38,39.59 R27.2 33.77,46.19 33.77,53.3 24.63,62.45 24.63,75.9 STM32F103C8T6.16 ; R28.2 46.15,28.73 v1(44.44,30.44)
SCL: length 22.3
  Top Layer w0.508: STM32F103C8T6.35 9.71,50.19 9.71,46 15.8,39.9 OLED.3
SDA: length 20.8
  Bottom Layer w0.508: OLED.4 10.22,41.43 10.22,47.14 STM32F103C8T6.36
SOLAR+: length 82.8
  Top Layer w1.27: Q3.2 62.22,78.23 61.14,77.15 61.14,61.91 52.25,53.02 48.44,53.02 44.63,49.21 44.63,42.86 D1.2
  Bottom Layer w1.27: H1_SolarBoard.1 75.48,94.04 62.22,80.78 Q3.2
SOLAR-: length 103.5
  Top Layer w1.268: Q3.3 64.76,71.88 64.67,71.79 ; v1(67.21,67.98) 64.67,70.52 64.67,71.79 ; v1(76.1,50.2) 76.1,54.01 73.56,56.55 v1(72.29,56.55) ; 64.67,71.79 R15.1
  Bottom Layer w1.268: R9.1 51.07,76.7 52.6,78.23 55.87,78.23 57.14,76.96 63.49,76.96 64.76,78.23 Q3.3 ; v1(76.1,50.2) 76.1,42.39 78.59,39.9 78.59,26.66 R16.1 ; v1(67.21,67.98) 72.29,62.9 v1(72.29,56.55)
  Bottom Layer w1.27: Q3.3 65.24,79.5 H1_SolarBoard.2
$1N47: length 8.7
  Bottom Layer w0.508: Q1.2 31.12,45.54 30.61,46.05 30.61,50.6 R1.2
$1N60: length 16.7
  Bottom Layer w0.508: C1.1 66.71,29.83 58.58,37.96 56,37.96 U1.2
$1N61: length 16.3
  Bottom Layer w0.508: U1.4 69.72,29.32 C1.2
$1N72: length 48.9
  Bottom Layer w0.508: R5.1 74.66,55.71 72.61,53.66 72.61,50.61 U3.7 69.06,46.04 65.03,42.01 53.86,42.01 53.35,41.5 53.35,38.45 54.87,36.93 54.87,28.76 R3.2
$1N76: length 56.2
  Top Layer w0.508: v1(93.94,17.43) 90.38,13.88 Q2.3 ; v1(85.3,45.37) 85.81,45.88 85.81,48.42 84,50.24 R4.2
  Bottom Layer w0.508: R8.2 94.91,17.43 v1(93.94,17.43) ; v1(85.3,45.37) 84.29,44.36 84.29,16.42 Q2.3
$1N96: length 27
  Top Layer w0.508: U3.2 70.58,37.91 72.48,37.91 74.81,35.58 81.92,35.58 R18.1
  Bottom Layer w0.508: R16.2 87.52,29.98 R18.1
$1N97: length 28.9
  Top Layer w0.508: U3.1 74.44,31.51 R18.2 79.61,27.69 R19.1
$1N102: length 99.9
  Top Layer w0.508: v1(46.69,82.25) 47.19,82.25 v1(51.77,86.82) ; v1(46.33,62.59) 46.33,59.54 45.31,58.53 42.77,58.53 C7.2 ; SW1.3 81.49,90.38 v1(61.42,90.38)
  Bottom Layer w0.508: v1(46.69,82.25) 45.16,82.25 42.26,79.35 42.26,68.18 46.33,64.11 v1(46.33,62.59) ; C7.2 38.71,50.18 R21.1 ; v1(61.42,90.38) 57.86,86.82 v1(51.77,86.82) ; SW1.3 SW1.4
$1N111: length 40.2
  Top Layer w0.508: v1(88.06,61.7) 87.56,62.2 87.56,63.73 88.06,64.24 88.06,69.32 87.56,69.83 87.56,71.98 SW2.3
  Bottom Layer w0.508: v1(88.06,61.7) 88.06,58.14 89.59,56.62 89.59,49 87.05,46.46 ; C8.2 87.16,46.46 R22.1 ; SW2.3 SW2.4
$1N116: length 63.5
  Bottom Layer w0.508: 92.26,63.85 93.68,63.85 SW3.4 ; 92.26,63.85 SW3.3 ; 92.26,63.85 92.26,42.23 R24.1 89,34.57 89,13.61 C9.2
$1N121: length 116.8
  Top Layer w0.508: v1(82.78,23.87) 88.37,23.87 91.93,27.43 91.93,29.97 94.47,32.51 94.47,53.94 SW4.3 SW4.4 ; C10.2 v1(57.38,12.7)
  Bottom Layer w0.508: R27.1 48.24,41.92 48.24,26.89 57.38,17.74 v1(57.38,12.7) ; v1(82.78,23.87) 82.78,22.86 73.13,13.2 C10.2
$1N162: length 26.6
  Top Layer w0.508: v1(38.02,32.86) 34.97,29.81 v1(34.97,25.24) ; R30.1 41.92,21.34 39.55,23.71 v1(36.5,23.71)
  Bottom Layer w0.508: v1(38.02,32.86) 33.45,37.43 Q9.2 ; v1(34.97,25.24) v1(36.5,23.71)
$1N174: length 13.2
  Bottom Layer w0.508: Q2.2 78.03,12.69 R31.1
$1N175: length 117.6
  Top Layer w0.508: v1(82.66,49.74) 82.66,50.76 v1(77.08,56.35) ; LED_Header.2 74.53,75.65 78.09,75.65 v1(82.66,71.08) ; v1(83.17,26.37) 84.69,26.37 v1(85.71,25.36)
  Bottom Layer w0.508: v1(85.71,25.36) 85.71,7.3 R31.2 ; v1(82.66,71.08) 80.63,69.05 75.55,69.05 74.03,67.52 74.03,65.49 77.08,62.44 v1(77.08,56.35) ; v1(82.66,49.74) 82.16,49.23 82.16,45.68 80.12,43.65 80.12,42.12 83.17,39.07 v1(83.17,26.37)
$1N181: length 6.1
  Top Layer w0.508: R4.1 73.8,47.4 U3.5
$1N184: length 94.4
  Top Layer w0.508: v1(81.81,53.77) 75.27,60.32 72.67,60.32 70.07,57.72 70.07,48.58 U3.6 ; R7.1 44.74,82.72 46.25,81.2 50.32,81.2 v1(51.34,80.19) ; R5.2 81.81,61.9 81.81,70.03 77.24,74.6 73.69,74.6 65.56,82.73 55.4,82.73 v1(53.88,81.2)
  Bottom Layer w0.508: v1(81.81,53.77) 81.81,55.8 R5.2 ; v1(53.88,81.2) 52.35,81.2 v1(51.34,80.19)
$1N187: length 67.4
  Bottom Layer w0.508: R6.2 20.15,5.75 68.55,5.75 Q2.1
$1N191: length 104.5
  Top Layer w0.508: R20.1 86.04,66.04 86.04,61.9 88.19,59.75 88.19,52.13 93.27,47.05 93.27,32.83 90.73,30.29 85.14,30.29 82.49,32.94 75.89,32.94 v1(72.44,36.39) ; v1(52.12,40.96) v1(55.17,40.96) ; R17.2 41.96,34.66 v1(49.58,34.66)
  Bottom Layer w0.508: v1(55.17,40.96) 69.9,40.96 71.42,39.43 ; 71.42,39.43 U3.3 ; 71.42,39.43 71.42,37.4 v1(72.44,36.39) ; v1(49.58,34.66) 49.58,38.93 51.61,40.96 v1(52.12,40.96)

## Text on the board
Top Silkscreen Layer: PWM_CHARGE | ADC_ICHARGE | ADC_ILED | PWM_LED | ADC_VBT | ADC_VSL | SCL | SDA | GND | 5V | S4 | S3 | S2 | S1 | VCC3V3 | VBAT | SOLAR+ | SOLAR-
